# Altium schematic sheet IIS2MDCTR_Schematic.SchDoc
size A
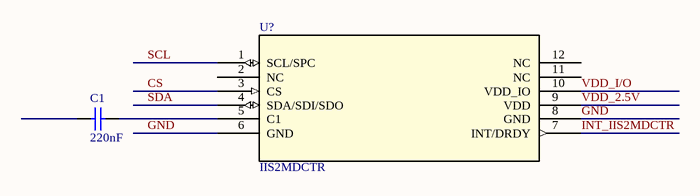
[diagram p0: IIS2MDCTR_Schematic.SchDoc]

## Parts
C1  value 220nF  (hidden comment: Capacitor)
U?  IIS2MDCTR  [LGA-12_2X2X0P7_STM]

## Nets
CS: U?.3(CS)
GND: U?.6(GND) U?.8(GND)
INT_IIS2MDCTR: U?.7(INT/DRDY)
SCL: U?.1(SCL/SPC)
SDA: U?.4(SDA/SDI/SDO)
VDD_2.5V: U?.9(VDD)
VDD_I/O: U?.10(VDD_IO)
NetC1_2: C1.2 U?.5(C1)

Not connected (* = marked no-connect by the designer): C1 1; U? 2(NC) 11(NC) 12(NC)

## Library data of the parts
C1 = Capacitor: SimulationGenericComponent: True
U? = IIS2MDCTR: No Description Available; Mfr_Name: STMicroelectronics; Copyright: Copyright (C) 2023 Ultra Librarian. All rights reserved.; Manufacturer_Part_Number: IIS2MDCTR; RefDes: RefDes; Type: DEV